# Altium project Tracking Radar PCB.PrjPcb (part 2 of 2)

## Sheet Debugger.SchDoc
size A4; Author: İlker KESER; Revision: V1.0; SheetNumber: 6; SheetTotal: 9; Page: 6; Page Total: 9; Project Code: 02050838; Template: A3
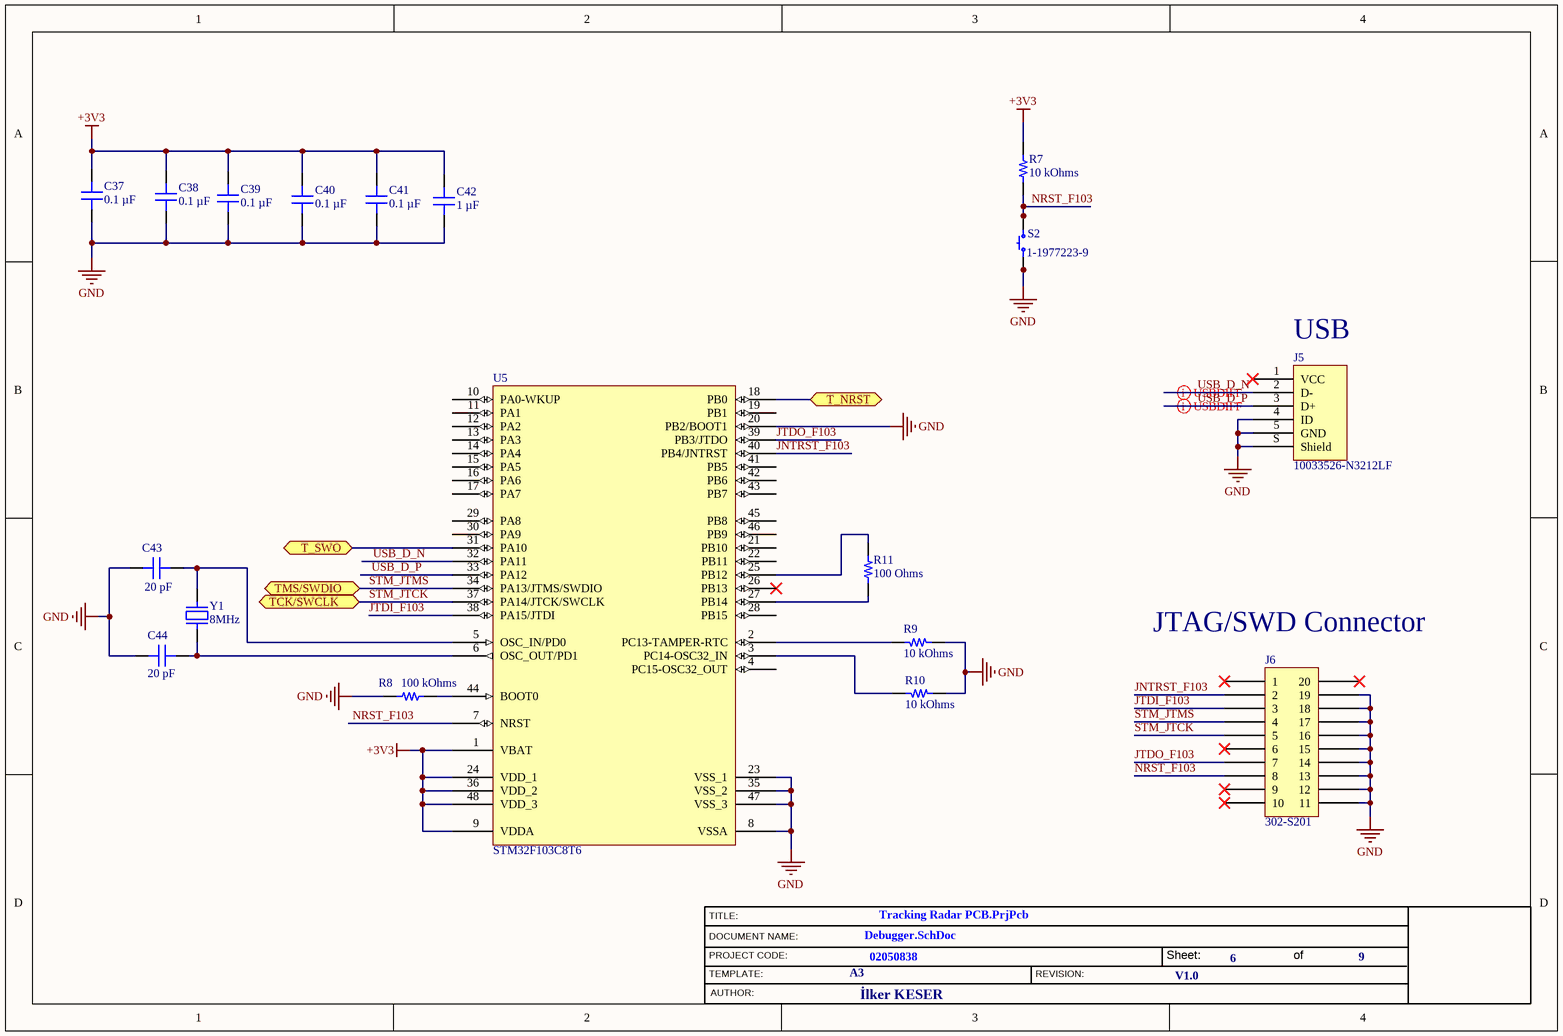
[diagram p5: Debugger.SchDoc]

### Parts
C37  0.1 µF  [CAP 0402_1005]
C38  0.1 µF  [CAP 0402_1005]
C39  0.1 µF  [CAP 0402_1005]
C40  0.1 µF  [CAP 0402_1005]
C41  0.1 µF  [CAP 0402_1005]
C42  1 µF  [CAP 0402_1005]
C43  20 pF  [CAP 0402_1005]
C44  20 pF  [CAP 0402_1005]
J5  10033526-N3212LF  [FCI USB 10033526-N3212LF]
J6  302-S201  [OST 302-S201]
R7  10 kOhms  [KOA RES RK73 RN73 0402_1005]
R8  100 kOhms  [YAGEO RES 0402_1005]
R9  10 kOhms  [KOA RES RK73 RN73 0402_1005]
R10  10 kOhms  [KOA RES RK73 RN73 0402_1005]
R11  100 Ohms  [YAGEO RES 0402_1005]
S2  1-1977223-9  [TE FSM6JSMA]
U5  STM32F103C8T6  [LQFP48_L]
Y1  8MHz  [TXC 9C]

### Ports
T_NRST (bidir, see Microcontroller[2C]), T_SWO (bidir, see Microcontroller[2A]), TCK/SWCLK (bidir, see Microcontroller[1B]), TMS/SWDIO (bidir, see Microcontroller[1B])

### Nets
+3V3: C37.2 C38.2 C39.2 C40.2 C41.2 C42.2 R7.1 U5.1(VBAT) U5.9(VDDA) U5.24(VDD_1) U5.36(VDD_2) U5.48(VDD_3)
GND: C37.1 C38.1 C39.1 C40.1 C41.1 C42.1 C43.1 C44.1 J5.4(ID) J5.5(GND) J5.S(Shield) J6.11 J6.12 J6.13 J6.14 J6.15 J6.16 J6.17 J6.18 J6.19 R8.1 R9.2 R10.2 S2.1 S2.2 U5.8(VSSA) U5.20(PB2/BOOT1) U5.23(VSS_1) U5.35(VSS_2) U5.47(VSS_3)
JNTRST_F103: J6.2 U5.40(PB4/JNTRST)
JTDI_F103: J6.3 U5.38(PA15/JTDI)
JTDO_F103: J6.7 U5.39(PB3/JTDO)
NRST: U5.18(PB0) ; port T_NRST
NRST_F103: J6.8 R7.2 S2.3 S2.4 U5.7(NRST)
STM_JTCK: J6.5 U5.37(PA14/JTCK/SWCLK) ; port TCK/SWCLK
STM_JTMS: J6.4 U5.34(PA13/JTMS/SWDIO) ; port TMS/SWDIO
USB_D_N: J5.2(D-) U5.32(PA11)
USB_D_P: J5.3(D+) U5.33(PA12)
NetC43_2: C43.2 U5.5(OSC_IN/PD0) Y1.2
NetC44_2: C44.2 U5.6(OSC_OUT/PD1) Y1.1
NetR8_2: R8.2 U5.44(BOOT0)
NetR9_1: R9.1 U5.2(PC13-TAMPER-RTC)
NetR10_1: R10.1 U5.3(PC14-OSC32_IN)
NetR11_1: R11.1 U5.27(PB14)
NetR11_2: R11.2 U5.25(PB12)
NetU4_89: U5.31(PA10) ; port T_SWO

Not connected (* = marked no-connect by the designer): J5 1(VCC)*; J6 1* 6* 9* 10* 20*; U5 4(PC15-OSC32_OUT) 10(PA0-WKUP) 11(PA1) 12(PA2) 13(PA3) 14(PA4) 15(PA5) 16(PA6) 17(PA7) 19(PB1) 21(PB10) 22(PB11) 26(PB13)* 28(PB15) 29(PA8) 30(PA9) 41(PB5) 42(PB6) 43(PB7) 45(PB8) 46(PB9)

### Layout directives
differential pair; differential pair class USB_DIFF: USB_D_N, USB_D_P

### Notes on the sheet
- (near J5) USB
- (near J6) JTAG/SWD Connector
- TITLE:
- DOCUMENT NAME:
- PROJECT CODE:
- TEMPLATE:
- REVISION:
- Sheet:
- of
- AUTHOR:

### Library data of the parts
C37-C41 = C0402C104M9PAC7867: CAP CER 0.1UF 6.3V X5R 0402; manufacturer: KEMET; Tolerance: ±20%; Part Number: C0402C104M9PAC7867; Capacitance: 0.1 µF; Applications: Bypass, Decoupling; componentlink1description: Datasheet; componentlink1url: https://api.kemet.com/component-edge/download/datasheet/C0402C104M9PACTU.pdf; componentlink2description: DigiKey Link; componentlink2url: https://www.digikey.com/en/products/detail/kemet/C0402C104M9PAC7867/2196244; Device Package: 0402 (1005 Metric); lastupdated: 9.02.2024 20:04:15; Lifecycle Status: Active; Minimum Order: 1; Mounting Type: Surface Mount, MLCC; Operating Temperature: -55°C ~ 85°C; Package / Case: 0402 (1005 Metric); packaging: CutTape; partid: 33676; Part Status: Active; price: 0.01; series: SMD Comm X5R; Size / Dimension: 0.039" L x 0.020" W (1.00mm x 0.50mm); Supplier 1: DigiKey; Supplier Part Number 1: 399-C0402C104M9PAC7867CT-ND; Temperature Coefficient: X5R; Thickness (Max): 0.022" (0.55mm); value: 0.1 µF; Voltage - Rated: 6.3V
C42 = GRM152R60J105ME15D: CAP CER 1UF 6.3V X5R 0402; manufacturer: Murata Electronics; Tolerance: ±20%; Part Number: GRM152R60J105ME15D; Capacitance: 1 µF; Applications: General Purpose; componentlink1description: Datasheet; componentlink1url: https://search.murata.co.jp/Ceramy/image/img/A01X/G101/ENG/GRM152R60J105ME15-01.pdf; componentlink2description: DigiKey Link; componentlink2url: https://www.digikey.com/en/products/detail/murata-electronics/GRM152R60J105ME15D/4904809; Device Package: 0402 (1005 Metric); lastupdated: 9.02.2024 20:04:33; Lifecycle Status: Active; Minimum Order: 1; Mounting Type: Surface Mount, MLCC; Operating Temperature: -55°C ~ 85°C; Package / Case: 0402 (1005 Metric); packaging: TapeAndReel; partid: 4147; Part Status: Active; price: 0.03; series: GRM; Size / Dimension: 0.039" L x 0.020" W (1.00mm x 0.50mm); Supplier 1: DigiKey; Supplier Part Number 1: 490-10006-1-ND; Temperature Coefficient: X5R; Thickness (Max): 0.009" (0.22mm); value: 1 µF; Voltage - Rated: 6.3V
C43 C44 = C0402C200K8GAC7867: CAP CER 20PF 10V NP0 0402; manufacturer: KEMET; Temperature Coefficient: C0G, NP0; Tolerance: ±10%; Part Number: C0402C200K8GAC7867; Capacitance: 20 pF; Applications: General Purpose; componentlink1description: Datasheet; componentlink1url: https://api.kemet.com/component-edge/download/datasheet/C0402C200K8GACTU.pdf; componentlink2description: DigiKey Link; componentlink2url: https://www.digikey.com/en/products/detail/kemet/C0402C200K8GAC7867/2196419; Device Package: 0402 (1005 Metric); Features: Low ESL; lastupdated: 9.02.2024 20:04:30; Lifecycle Status: Active; Minimum Order: 1; Mounting Type: Surface Mount, MLCC; Operating Temperature: -55°C ~ 125°C; Package / Case: 0402 (1005 Metric); packaging: TapeAndReel; partid: 6572; Part Status: Active; price: 0.06; series: SMD Comm C0G; Size / Dimension: 0.039" L x 0.020" W (1.00mm x 0.50mm); Supplier 1: DigiKey; Supplier Part Number 1: 399-14429-1-ND; Thickness (Max): 0.022" (0.55mm); value: 20 pF; Voltage - Rated: 10V
J5 = 10033526-N3212LF: CONN RCPT MINI USB B 5POS SMD RA; Manufacturer: Amphenol ICC (FCI); Connector Type: USB - mini B; Current Rating (Amps): 1A per Contact; Gender: Receptacle; Mating Cycles: 5000; Number of Contacts: 5; Number of Ports: 1; Shielding: Shielded; Voltage - Rated: 30V; Part Number: 10033526-N3212LF; ComponentLink1Description: Datasheet; ComponentLink1URL: http://www.amphenol-icc.com/media/wysiwyg/files/drawing/10033526.pdf; ComponentLink2Description: DigiKey Link; ComponentLink2URL: //digikey.com/product-detail/en/amphenol-icc-fci/10033526-N3212LF/609-4700-2-ND/4292074; Features: Board Guide, Solder Retention; LastUpdated: 9.12.2019 20:52:14; Lifecycle Status: 0; Minimum Order: 1; Mounting Feature: Horizontal; Mounting Type: Surface Mount, Right Angle; Operating Temperature: -25°C ~ 85°C; Packaging: TapeAndReel; Part Status: Active; Price: 0.39; Series: -; Supplier 1: DigiKey; Supplier Part Number 1: 609-4700-2-ND; Termination: Solder
J6 = 302-S201: CONN HEADER VERT 20POS 2.54MM; Manufacturer: On Shore Technology Inc.; Contact Length - Post: 0.122" (3.10mm); Current Rating (Amps): 3A; Material Flammability Rating: UL94 V-0; Number of Positions: 20; Number of Positions Loaded: All; Pitch - Mating: 0.100" (2.54mm); Shrouding: Shrouded - 4 Wall; Style: Board to Cable/Wire; Part Number: 302-S201; ComponentLink1Description: Datasheet; ComponentLink1URL: http://www.on-shore.com/wp-content/uploads/2018/04/302-SXX1.pdf; ComponentLink2Description: DigiKey Link; ComponentLink2URL: https://www.digikey.com/en/products/detail/on-shore-technology-inc/302-S201/2794235; Connector Type: Header; Contact Finish - Mating: Gold; Contact Finish - Post: Gold; Contact Finish Thickness - Mating: Flash; Contact Material: Brass; Contact Shape: Square; Contact Type: Male Pin; Fastening Type: Push-Pull; Features: Keying Slot; Insulation Color: Black; Insulation Height: 0.358" (9.10mm); Insulation Material: Polyester, Glass Filled; LastUpdated: 14.08.2022 17:03:46; Lifecycle Status: Active; Minimum Order: 1; Mounting Type: Through Hole; Number of Rows: 2; Operating Temperature: -40°C ~ 105°C; Packaging: Tray; PartId: 155; Part Status: Active; Price: 0.19; Row Spacing - Mating: 0.100" (2.54mm); Series: 302; Supplier 1: DigiKey; Supplier Part Number 1: ED10524-ND; Termination: Solder
R7 R9 R10 = RK73H1ETTP1002D: RES 10K OHM 0.5% 1/10W 0402; Manufacturer: KOA Speer Electronics, Inc.; Power (Watts): 0.1W, 1/10W; Temperature Coefficient: ±100ppm/°C; Part Number: RK73H1ETTP1002D; Value: 10 kOhms; ComponentLink1Description: Datasheet; ComponentLink1URL: http://www.koaspeer.com/catimages/Products/RK73H/RK73H.pdf; ComponentLink2Description: DigiKey Link; ComponentLink2URL: https://www.digikey.com/en/products/detail/koa-speer-electronics-inc/RK73H1ETTP1002D/9844692; Composition: Thick Film; Device Package: 0402 (1005 Metric); Features: Automotive AEC-Q200; Height - Seated (Max): 0.016" (0.40mm); LastUpdated: 25.07.2024 09:41:31; Lifecycle Status: Active; Minimum Order: 1; Number of Terminations: 2; Operating Temperature: -55°C ~ 155°C; Package / Case: 0402 (1005 Metric); Packaging: TapeAndReel; PartId: 14647; Part Status: Active; Price: 0.03; Ratings: AEC-Q200; Resistance: 10 kOhms; Series: RK73H; Size / Dimension: 0.039" L x 0.020" W (1.00mm x 0.50mm); Supplier 1: DigiKey; Supplier Part Number 1: 2019-RK73H1ETTP1002DCT-ND; Supplier Device Package: 0402; Tolerance: ±0.5%
R8 = RP0402BRD07100KL: RES 100K OHM 0.1% 1/16W 0402; Manufacturer: Yageo; Power (Watts): 0.063W, 1/16W; Temperature Coefficient: ±25ppm/°C; Part Number: RP0402BRD07100KL; Value: 100 kOhms; ComponentLink1Description: Datasheet; ComponentLink1URL: https://www.yageo.com/upload/media/product/products/datasheet/rchip/PYu-RP_51_RoHS_L_0.pdf; ComponentLink2Description: DigiKey Link; ComponentLink2URL: https://www.digikey.com/en/products/detail/yageo/RP0402BRD07100KL/16916706; Composition: Thin Film; Device Package: 0402 (1005 Metric); Features: Anti-Sulfur, Automotive AEC-Q200, Moisture Resistant; Height - Seated (Max): 0.014" (0.35mm); LastUpdated: 25.07.2024 09:18:00; Lifecycle Status: Active; Minimum Order: 1; Number of Terminations: 2; Operating Temperature: -55°C ~ 155°C; Package / Case: 0402 (1005 Metric); Packaging: TapeAndReel; PartId: 70016; Part Status: Active; Price: 0.06; Resistance: 100 kOhms; Series: RP; Size / Dimension: 0.039" L x 0.020" W (1.00mm x 0.50mm); Supplier 1: DigiKey; Supplier Part Number 1: 13-RP0402BRD07100KLCT-ND; Supplier Device Package: 0402; Tolerance: ±0.1%
R11 = RP0402BRD07100RL: RES 100 OHM 0.1% 1/16W 0402; Manufacturer: Yageo; Power (Watts): 0.063W, 1/16W; Temperature Coefficient: ±25ppm/°C; Part Number: RP0402BRD07100RL; Value: 100 Ohms; ComponentLink1Description: Datasheet; ComponentLink1URL: https://www.yageo.com/upload/media/product/products/datasheet/rchip/PYu-RP_51_RoHS_L_0.pdf; ComponentLink2Description: DigiKey Link; ComponentLink2URL: https://www.digikey.com/en/products/detail/yageo/RP0402BRD07100RL/16916732; Composition: Thin Film; Device Package: 0402 (1005 Metric); Features: Anti-Sulfur, Automotive AEC-Q200, Moisture Resistant; Height - Seated (Max): 0.014" (0.35mm); LastUpdated: 25.07.2024 09:18:00; Lifecycle Status: Active; Minimum Order: 1; Number of Terminations: 2; Operating Temperature: -55°C ~ 155°C; Package / Case: 0402 (1005 Metric); Packaging: TapeAndReel; PartId: 69963; Part Status: Active; Price: 0.06; Resistance: 100 Ohms; Series: RP; Size / Dimension: 0.039" L x 0.020" W (1.00mm x 0.50mm); Supplier 1: DigiKey; Supplier Part Number 1: 13-RP0402BRD07100RLCT-ND; Supplier Device Package: 0402; Tolerance: ±0.1%
S2 = 1-1977223-9: SWITCH TACTILE SPST-NO 0.05A 24V; Manufacturer: TE Connectivity ALCOSWITCH Switches; Actuator Height off PCB, Vertical: 7.00mm; Actuator Orientation: Top Actuated; Actuator Type: Standard; Contact Rating @ Voltage: 0.05A @ 24VDC; Illumination: Non-Illuminated; Operating Force: 260gf; Outline: 6.00mm x 6.00mm; Switch Function: Off-Mom; Part Number: 1-1977223-9; Circuit: SPST-NO; ComponentLink1Description: Datasheet; ComponentLink1URL: https://www.te.com/commerce/DocumentDelivery/DDEController?Action=srchrtrv&DocNm=1308111-1_SWITCHES_CORE_PROGRAM_CATALOG&DocType=CS&DocLang=English; ComponentLink2Description: DigiKey Link; ComponentLink2URL: http://digikey.com/product-detail/en/te-connectivity-alcoswitch-switches/1-1977223-9/1-1977223-9-ND/5401299; LastUpdated: 3.06.2024 20:19:31; Lifecycle Status: Active; Minimum Order: 1500; Mounting Type: Surface Mount; Packaging: Bulk; Price: 0.36; Series: FSMJSMA; Supplier 1: DigiKey; Supplier Part Number 1: 1-1977223-9-ND; Termination Style: Gull Wing
U5 = STM32F103C8T6: STM32 ARM-based 32-bit MCU with 64 Kbytes Flash, 48-pin LQFP, Industrial Temperature; Published: 30-May-2008; DatasheetVersion: rev6, Mar-2008; PackageVersion: Mar-2008; PackageReference: LQFP48; Publisher: Altium Limited; PackageDescription: 48-Pin Low-Profile Quad Flat Pack, 7 x 7 mm Body, 0.5 mm Pitch (LQFP48); ComponentLink1Description: Manufacturer Link; ComponentLink1URL: www.st.com/stm32; ComponentLink2Description: Datasheet; ComponentLink2URL: http://www.st.com/stonline/products/literature/ds/13587.pdf
Y1 = 9C-8.000MBBK-T: CRYSTAL 8.0000MHZ 20PF SMD; Manufacturer: TXC CORPORATION; ESR (Equivalent Series Resistance): 80 Ohms; Frequency Stability: ±50ppm; Operating Mode: Fundamental; Part Number: 9C-8.000MBBK-T; ComponentLink1Description: Datasheet; ComponentLink1URL: http://www.txccorp.com/download/products/quartz_crystals/2015TXC_9C_32.pdf; ComponentLink2Description: DigiKey Link; ComponentLink2URL: http://digikey.com/product-detail/en/txc-corporation/9C-8.000MBBK-T/887-2475-1-ND/4475454; Frequency: 8MHz; Frequency Tolerance: ±50ppm; Height - Seated (Max): 0.161" (4.10mm); LastUpdated: 3.06.2024 20:02:24; Lifecycle Status: Active; Load Capacitance: 20pF; Minimum Order: 1; Mounting Type: Surface Mount; Operating Temperature: -20°C ~ 70°C; Package / Case: HC-49S; Packaging: TapeAndReel; PartId: 697; Part Status: Active; Price: 0.18; Series: 9C; Size / Dimension: 0.449" L x 0.189" W (11.40mm x 4.80mm); Supplier 1: DigiKey; Supplier Part Number 1: 887-2475-1-ND; Type: MHz Crystal; Value: 8MHz

## Sheet LoRa_Com.SchDoc
size A4; Author: İlker KESER; Revision: V1.0; SheetNumber: 7; SheetTotal: 9; Page: 7; Project Code: 02050838; Template: A4; Page Total: 9
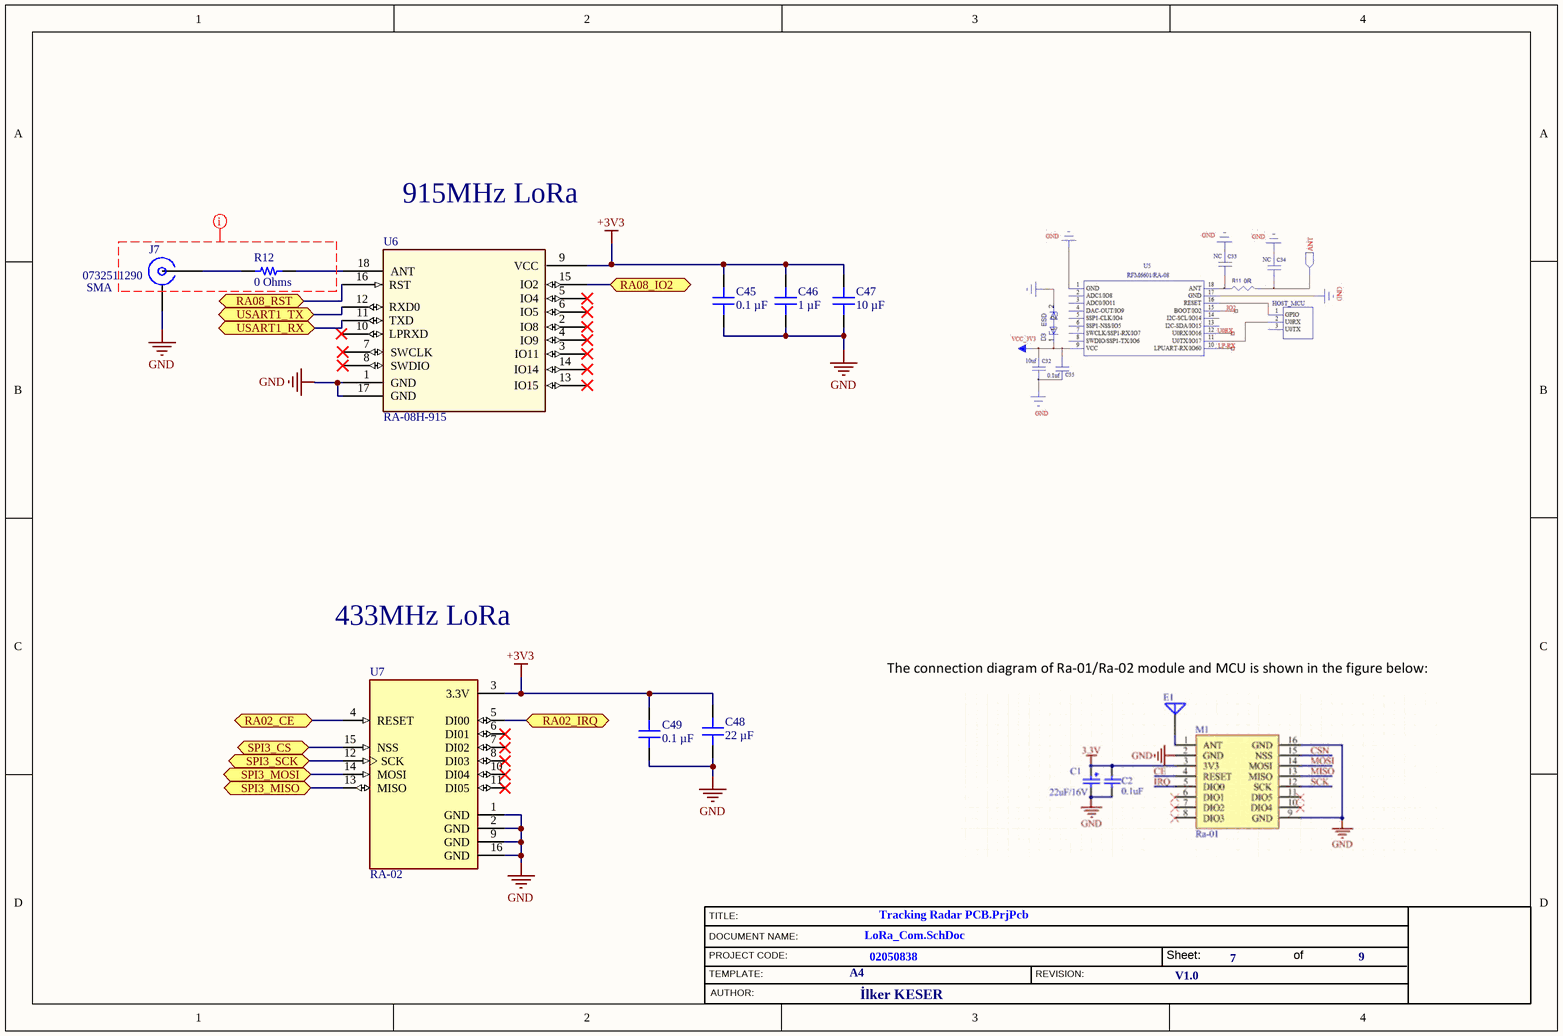
[diagram p6: LoRa_Com.SchDoc]

### Parts
C45  0.1 µF  [CAP 0402_1005]
C46  1 µF  [CAP 0402_1005]
C47  10 µF  [MURATA GRM188 0603_1608]
C48  22 µF  [MURATA GRM188 0603_1608]
C49  0.1 µF  [CAP 0603_1608]
J7  0732511290  Connector Style: SMA  [MOLEX SD-73251-129]
R12  0 Ohms  [RES 1206_3216]
U6  RA-08H-915  [RA-08H-915]
U7  RA-02  [RA-02]

### Ports
RA02_CE (bidir, see Microcontroller[2B]), RA02_IRQ (bidir, see Microcontroller[2B]), RA08_IO2 (bidir, see Microcontroller[1B]), RA08_RST (bidir, see Microcontroller[1A]), SPI3_CS (bidir, see Microcontroller[2B]), SPI3_MISO (bidir, see Microcontroller[1C]), SPI3_MOSI (bidir, see Microcontroller[1C]), SPI3_SCK (bidir, see Microcontroller[1C]), USART1_RX (bidir, see Microcontroller[1B]), USART1_TX (bidir, see Microcontroller[1B])

### Nets
+3V3: C45.2 C46.2 C47.2 C48.2 C49.2 U6.9(VCC) U7.3(3.3V)
GND: C45.1 C46.1 C47.1 C48.1 C49.1 J7.G(GND) U6.1(GND) U6.17(GND) U7.1(GND) U7.2(GND) U7.9(GND) U7.16(GND)
NetJ7_S: J7.S(SIGNAL) R12.1
NetR12_2: R12.2 U6.18(ANT)
NetU4_66: U6.15(IO2) ; port RA08_IO2
NetU4_67: U6.16(RST) ; port RA08_RST
NetU4_68: U6.12(RXD0) ; port USART1_TX
NetU4_69: U6.11(TXD) ; port USART1_RX
NetU4_78: U7.12(SCK) ; port SPI3_SCK
NetU4_79: U7.13(MISO) ; port SPI3_MISO
NetU4_80: U7.14(MOSI) ; port SPI3_MOSI
NetU4_81: U7.15(NSS) ; port SPI3_CS
NetU4_82: U7.5(DI00) ; port RA02_IRQ
NetU4_83: U7.4(RESET) ; port RA02_CE

Not connected (* = marked no-connect by the designer): U6 2(IO8)* 3(IO11)* 4(IO9)* 5(IO4)* 6(IO5)* 7(SWCLK)* 8(SWDIO)* 10(LPRXD)* 13(IO15)* 14(IO14)*; U7 6(DI01)* 7(DI02)* 8(DI03)* 10(DI04)* 11(DI05)*

### Layout directives
net class 50OHM: (no net found under the mark)

### Notes on the sheet
- 915MHz LoRa
- 433MHz LoRa
- TITLE:
- DOCUMENT NAME:
- PROJECT CODE:
- TEMPLATE:
- REVISION:
- Sheet:
- of
- AUTHOR:

### Library data of the parts
C45 = C0402C104M9PAC7867: as C37 on sheet Debugger; Part Number: C0402C104M9PAC7867; Capacitance: 0.1 µF; Applications: Bypass, Decoupling; componentlink1description: Datasheet; componentlink1url: https://api.kemet.com/component-edge/download/datasheet/C0402C104M9PACTU.pdf; componentlink2description: DigiKey Link; componentlink2url: https://www.digikey.com/en/products/detail/kemet/C0402C104M9PAC7867/2196244; Device Package: 0402 (1005 Metric); lastupdated: 9.02.2024 20:04:15; Lifecycle Status: Active; Minimum Order: 1; Mounting Type: Surface Mount, MLCC; Operating Temperature: -55°C ~ 85°C; Package / Case: 0402 (1005 Metric); packaging: CutTape; partid: 33676; Part Status: Active; price: 0.01; series: SMD Comm X5R; Size / Dimension: 0.039" L x 0.020" W (1.00mm x 0.50mm); Supplier 1: DigiKey; Supplier Part Number 1: 399-C0402C104M9PAC7867CT-ND; Temperature Coefficient: X5R; Thickness (Max): 0.022" (0.55mm); value: 0.1 µF; Voltage - Rated: 6.3V
C46 = GRM152R60J105ME15D: as C42 on sheet Debugger; Part Number: GRM152R60J105ME15D; Capacitance: 1 µF; Applications: General Purpose; componentlink1description: Datasheet; componentlink1url: https://search.murata.co.jp/Ceramy/image/img/A01X/G101/ENG/GRM152R60J105ME15-01.pdf; componentlink2description: DigiKey Link; componentlink2url: https://www.digikey.com/en/products/detail/murata-electronics/GRM152R60J105ME15D/4904809; Device Package: 0402 (1005 Metric); lastupdated: 9.02.2024 20:04:33; Lifecycle Status: Active; Minimum Order: 1; Mounting Type: Surface Mount, MLCC; Operating Temperature: -55°C ~ 85°C; Package / Case: 0402 (1005 Metric); packaging: TapeAndReel; partid: 4147; Part Status: Active; price: 0.03; series: GRM; Size / Dimension: 0.039" L x 0.020" W (1.00mm x 0.50mm); Supplier 1: DigiKey; Supplier Part Number 1: 490-10006-1-ND; Temperature Coefficient: X5R; Thickness (Max): 0.009" (0.22mm); value: 1 µF; Voltage - Rated: 6.3V
C47 = GRM188R61A106MAALD: CAP CER 10UF 10V X5R 0603; manufacturer: Murata Electronics; Tolerance: ±20%; Part Number: GRM188R61A106MAALD; Capacitance: 10 µF; Applications: General Purpose; componentlink1description: Datasheet; componentlink1url: https://search.murata.co.jp/Ceramy/image/img/A01X/G101/ENG/GRM188R61A106MAAL-01.pdf; componentlink2description: DigiKey Link; componentlink2url: https://www.digikey.com/en/products/detail/murata-electronics/GRM188R61A106MAALD/4905335; Device Package: 0603 (1608 Metric); lastupdated: 20.07.2024 00:23:22; Lifecycle Status: Active; Minimum Order: 1; Mounting Type: Surface Mount, MLCC; Operating Temperature: -55°C ~ 85°C; Package / Case: 0603 (1608 Metric); packaging: TapeAndReel; partid: 40505; Part Status: Active; price: 0.03; series: GRM; Size / Dimension: 0.063" L x 0.031" W (1.60mm x 0.80mm); Supplier 1: DigiKey; Supplier Part Number 1: 490-12734-1-ND; Temperature Coefficient: X5R; Thickness (Max): 0.037" (0.95mm); value: 10 µF; Voltage - Rated: 10V
C48 = GRM188C61C226ME01W: CAP CER 22UF 16V X5S 0603; manufacturer: Murata Electronics; Tolerance: ±20%; Part Number: GRM188C61C226ME01W; Capacitance: 22 µF; Applications: General Purpose; componentlink1description: Datasheet; componentlink1url: https://search.murata.co.jp/Ceramy/image/img/A01X/G101/ENG/GRM188C61C226ME01-01A.pdf; componentlink2description: DigiKey Link; componentlink2url: https://www.digikey.com/en/products/detail/murata-electronics/GRM188C61C226ME01W/22528390; Device Package: 0603 (1608 Metric); lastupdated: 20.07.2024 00:23:18; Lifecycle Status: Active; Minimum Order: 1; Mounting Type: Surface Mount, MLCC; Operating Temperature: -55°C ~ 85°C; Package / Case: 0603 (1608 Metric); packaging: TapeAndReel; partid: 60288; price: 0.09; series: GRM; Size / Dimension: 0.063" L x 0.031" W (1.60mm x 0.80mm); Supplier 1: DigiKey; Supplier Part Number 1: 490-GRM188C61C226ME01WCT-ND; Temperature Coefficient: X5S; Thickness (Max): 0.039" (1.00mm); value: 22 µF; Voltage - Rated: 16V
C49 = 885012206046: CAP CER 0.1UF 16V X7R 0603; manufacturer: Würth Elektronik; Tolerance: ±10%; Part Number: 885012206046; Capacitance: 0.1 µF; Applications: General Purpose; componentlink1description: Datasheet; componentlink1url: https://katalog.we-online.de/pbs/datasheet/885012206046.pdf; componentlink2description: DigiKey Link; componentlink2url: https://www.digikey.com/en/products/detail/würth-elektronik/885012206046/5453820; Device Package: 0603 (1608 Metric); lastupdated: 9.02.2024 20:10:12; Lifecycle Status: Active; Minimum Order: 1; Mounting Type: Surface Mount, MLCC; Operating Temperature: -55°C ~ 125°C; Package / Case: 0603 (1608 Metric); packaging: TapeAndReel; partid: 15291; Part Status: Active; price: 0.03; series: WCAP-CSGP; Size / Dimension: 0.063" L x 0.031" W (1.60mm x 0.80mm); Supplier 1: DigiKey; Supplier Part Number 1: 732-7965-1-ND; Temperature Coefficient: X7R; Thickness (Max): 0.034" (0.87mm); value: 0.1 µF; Voltage - Rated: 16V
J7 = 0732511290: CONN SMA JACK STR 50OHM EDGE MNT; Manufacturer: Molex; Connector Type: Jack, Female Socket; Contact Termination: Solder; Frequency - Max: 18 GHz; Number of Ports: 1; Part Number: 0732511290; ComponentLink1Description: Datasheet; ComponentLink1URL: https://www.molex.com/pdm_docs/ps/PS-89675-346.pdf; ComponentLink2Description: DigiKey Link; ComponentLink2URL: https://www.digikey.com/en/products/detail/molex/0732511290/3878247; Fastening Type: Threaded; Housing Color: Gold; Impedance: 50Ohm; LastUpdated: 29.06.2022 18:07:55; Lifecycle Status: Active; Minimum Order: 1; Mounting Feature: Bulkhead - Front Side Nut; Mounting Type: Board Edge, End Launch; Panel Mount; Packaging: Tray; Part Status: Active; Price: 4.46; Series: 73251; Shield Termination: Solder; Supplier 1: DigiKey; Supplier Part Number 1: WM9461-ND
R12 = CRCW12060000Z0EB: RES SMD 0 OHM JUMPER 1/4W 1206; Manufacturer: Vishay Dale; Power (Watts): 0.25W, 1/4W; Part Number: CRCW12060000Z0EB; ComponentLink1Description: Datasheet; ComponentLink1URL: http://www.vishay.com/docs/20035/dcrcwe3.pdf; ComponentLink2Description: DigiKey Link; ComponentLink2URL: https://www.digikey.com/en/products/detail/vishay-dale/CRCW12060000Z0EB/5076259; Composition: Thick Film; Device Package: 1206 (3216 Metric); Features: Automotive AEC-Q200; Height - Seated (Max): 0.024" (0.60mm); LastUpdated: 9.02.2024 20:54:45; Lifecycle Status: Active; Minimum Order: 1; Number of Terminations: 2; Operating Temperature: -55°C ~ 155°C; Package / Case: 1206 (3216 Metric); Packaging: TapeAndReel; PartId: 26977; Part Status: Active; Price: 0.01; Ratings: AEC-Q200; Resistance: 0 Ohms; Series: CRCW; Size / Dimension: 0.126" L x 0.063" W (3.20mm x 1.60mm); Supplier 1: DigiKey; Supplier Part Number 1: 541-3032-1-ND; Supplier Device Package: 1206; Tolerance: Jumper; Value: 0 Ohms
U6 = RA-08H-915: RF TXRX MODULE 915MHZ LORAWAN; Manufacturer: Ai-Thinker; ComponentLink1Description: Datasheet; ComponentLink1URL: https://docs.ai-thinker.com/_media/lora/docs/ra-08h_v1.1.0_specification.pdf; ComponentLink2Description: Digikey Link; ComponentLink2URL: https://www.digikey.com/en/products/detail/ai-thinker/RA-08H-915/16707689
U7 = RA-02: General ISM < 1GHz LoRa™ Transceiver Module 410MHz ~ 525MHz Antenna Not Included, I-PEX Surface Mount; Manufacturer: Ai-Thinker; Current - Transmitting: 93mA ~ 97mA; Current - Receiving: 12.15mA; Voltage - Supply: 2.5V ~ 3.7V; Serial Interfaces: SPI; Protocol: LoRa; Modulation: FSK, GFSK, GMSK, MSK, OOK; Data Rate: 300kbps; Power - Output: 18dBm; Sensitivity: -141dBm; ComponentLink1Description: Product Specification; ComponentLink1URL: https://docs.ai-thinker.com/_media/lora/docs/c048ps01a1_ra-02_product_specification_v1.1.pdf; ComponentLink2Description: Digikey Link; ComponentLink2URL: https://www.digikey.com/en/products/detail/ai-thinker/RA-02/16688840; Package / Case: 16-SMD Module; Operating Temperature: -30°C ~ 85°C; Mounting Type: Surface Mount; Antenna Type: Antenna Not Included, I-PEX; RF Family/Standard: General ISM < 1GHz; Frequency: 410MHz ~ 525MHz

## Sheet GPS_GNSS.SchDoc
size A3; Author: İlker KESER; Revision: V1.0; SheetNumber: 8; SheetTotal: 9; Page: 8; Page Total: 9; Template: A3; Project Code: 02050838
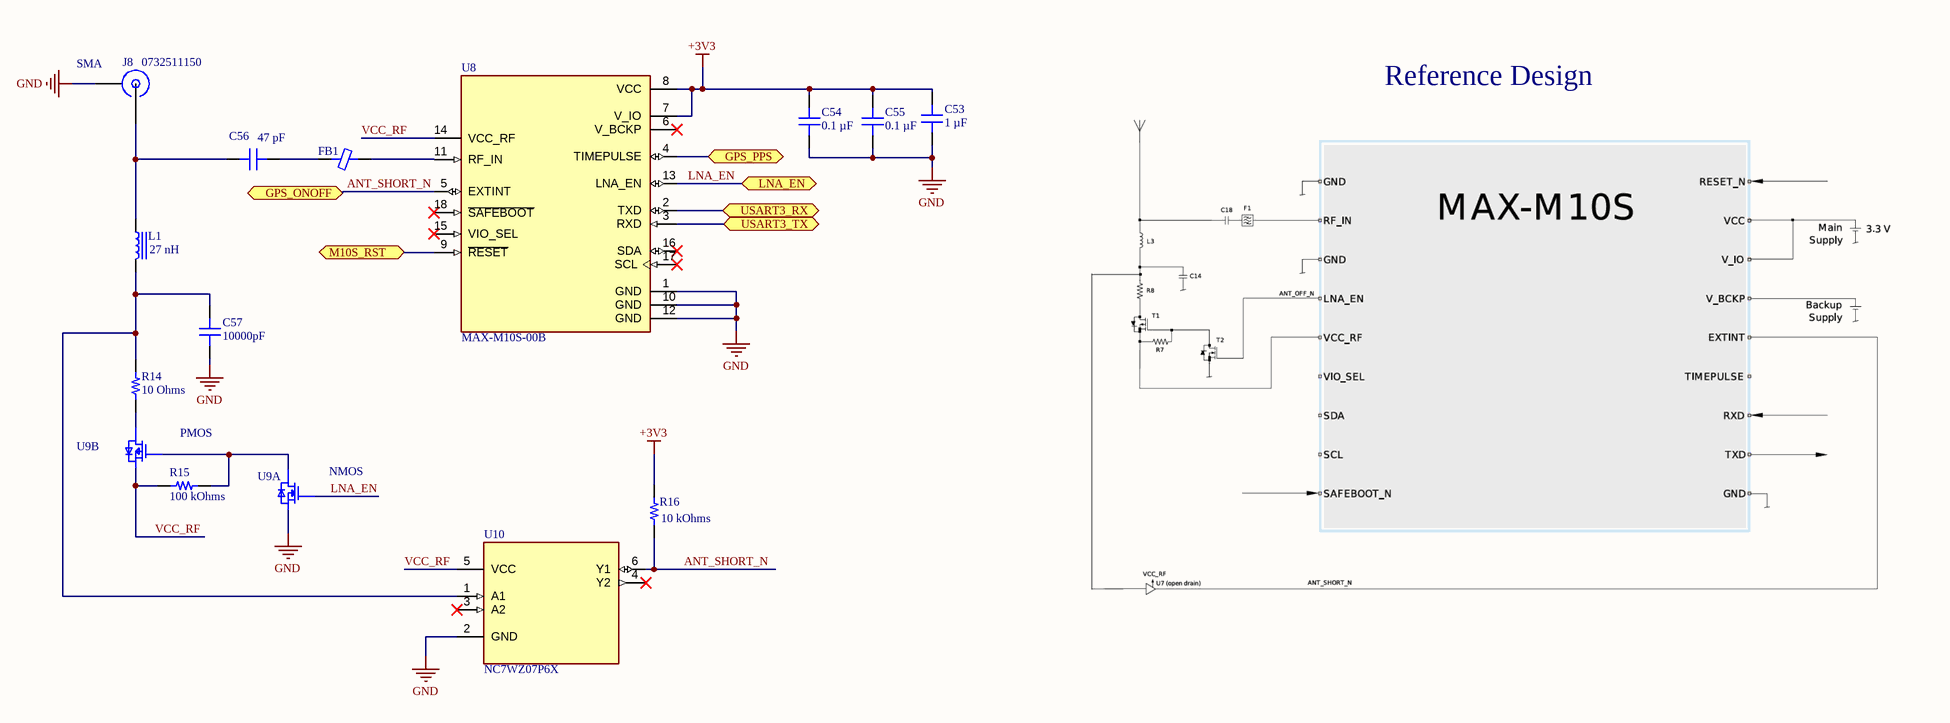
[diagram p7: GPS_GNSS.SchDoc]

### Parts
C53  1 µF  [MURATA GRM155 0402_1005]
C54  0.1 µF  [CAP 0402_1005]
C55  0.1 µF  [CAP 0402_1005]
C56  47 pF  [CAP 0402_1005]
C57  10000pF  [CAP 0603_1608 RF]
FB1  1 kOhms @ 100 MHz  [FER 0402_1005]  (value not drawn)
J8  0732511150  Connector Style: SMA  [MOLEX SD-73251-115]
L1  27 nH  [Murata LQG15 0402]
R14  10 Ohms  [YAGEO RES 0402_1005]
R15  100 kOhms  [YAGEO RES 0603_1608]
R16  10 kOhms  [KOA RES RK73 RN73 0402_1005]
U8  MAX-M10S-00B  [MAX-M10S-00B]
U9  DMC2700UDM-7  [SOT-23-6]  (value not drawn)  (parts A,B of 2)
U10  NC7WZ07P6X  [NC7WZ07P6X]

### Ports
GPS_ONOFF (bidir, see Microcontroller[2C]), GPS_PPS (bidir, see Microcontroller[2C]), LNA_EN (bidir, see Microcontroller[2C]), M10S_RST (bidir, see Microcontroller[2C]), USART3_RX (bidir, see Microcontroller[2B]), USART3_TX (bidir, see Microcontroller[2B])

### Nets
+3V3: C53.2 C54.2 C55.2 R16.1 U8.7(V_IO) U8.8(VCC)
GND: C53.1 C54.1 C55.1 C57.2 J8.G(GND) U8.1(GND) U8.10(GND) U8.12(GND) U9.5(S1) U10.2(GND)
ANT_SHORT_N: R16.2 U8.5(EXTINT) U10.6(Y1) ; port GPS_ONOFF
LNA_EN: U8.13(LNA_EN) U9.1(G1) ; port LNA_EN
VCC_RF: R15.1 U8.14(VCC_RF) U9.2(S2) U10.5(VCC)
NetC56_1: C56.1 J8.S(SIGNAL) L1.1
NetC56_2: C56.2 FB1.1
NetC57_1: C57.1 L1.2 R14.2 U10.1(A1)
NetFB1_2: FB1.2 U8.11(RF_IN)
NetR14_1: R14.1 U9.4(D2)
NetR15_2: R15.2 U9.3(G2) U9.6(D1)
NetU4_55: U8.3(RXD) ; port USART3_TX
NetU4_56: U8.2(TXD) ; port USART3_RX
NetU4_57: U8.9(~{RESET}) ; port M10S_RST
NetU4_60: U8.4(TIMEPULSE) ; port GPS_PPS

Not connected (* = marked no-connect by the designer): U8 6(V_BCKP)* 15(VIO_SEL)* 16(SDA)* 17(SCL)* 18(~{SAFEBOOT})*; U10 3(A2)* 4(Y2)*

### Notes on the sheet
- Reference Design
- TITLE:
- DOCUMENT NAME:
- PROJECT CODE:
- TEMPLATE:
- REVISION:
- Sheet:
- of
- AUTHOR:
- (in symbol DMC2700UDM-7, part A) NMOS
- (in symbol DMC2700UDM-7, part B) PMOS

### Library data of the parts
C53 = GRM155Z71A105KE01J: CAP CER 1UF 10V X7R 0402; manufacturer: Murata Electronics; Tolerance: ±10%; Part Number: GRM155Z71A105KE01J; Capacitance: 1 µF; Applications: General Purpose; componentlink1description: Datasheet; componentlink1url: https://search.murata.co.jp/Ceramy/image/img/A01X/G101/ENG/GRM155Z71A105KE01-01A.pdf; componentlink2description: DigiKey Link; componentlink2url: https://www.digikey.com/en/products/detail/murata-electronics/GRM155Z71A105KE01J/16033607; Device Package: 0402 (1005 Metric); lastupdated: 27.08.2024 12:42:50; Lifecycle Status: Active; Minimum Order: 1; Mounting Type: Surface Mount, MLCC; Operating Temperature: -55°C ~ 125°C; Package / Case: 0402 (1005 Metric); packaging: TapeAndReel; partid: 41629; Part Status: Active; price: 0.01; series: GRM; Size / Dimension: 0.039" L x 0.020" W (1.00mm x 0.50mm); Supplier 1: DigiKey; Supplier Part Number 1: 490-GRM155Z71A105KE01JCT-ND; Temperature Coefficient: X7R; Thickness (Max): 0.024" (0.60mm); value: 1 µF; Voltage - Rated: 10V
C54 C55 = 885012205018: CAP CER 0.1UF 10V X7R 0402; manufacturer: Würth Elektronik; Tolerance: ±10%; Part Number: 885012205018; Capacitance: 0.1 µF; Applications: General Purpose; componentlink1description: Datasheet; componentlink1url: https://katalog.we-online.de/pbs/datasheet/885012205018.pdf; componentlink2description: DigiKey Link; componentlink2url: https://www.digikey.com/en/products/detail/würth-elektronik/885012205018/5453368; Device Package: 0402 (1005 Metric); lastupdated: 9.02.2024 20:04:24; Lifecycle Status: Active; Minimum Order: 1; Mounting Type: Surface Mount, MLCC; Operating Temperature: -55°C ~ 125°C; Package / Case: 0402 (1005 Metric); packaging: TapeAndReel; partid: 10108; Part Status: Active; price: 0.01; series: WCAP-CSGP; Size / Dimension: 0.039" L x 0.020" W (1.00mm x 0.50mm); Supplier 1: DigiKey; Supplier Part Number 1: 732-7513-1-ND; Temperature Coefficient: X7R; Thickness (Max): 0.022" (0.55mm); value: 0.1 µF; Voltage - Rated: 10V
C56 = C0402C470J3GACAUTO: CAP CER 47PF 25V C0G/NP0 0402; manufacturer: KEMET; Temperature Coefficient: C0G, NP0; Tolerance: ±5%; Part Number: C0402C470J3GACAUTO; Capacitance: 47 pF; Applications: Automotive; componentlink1description: Datasheet; componentlink1url: https://connect.kemet.com:7667/gateway/IntelliData-ComponentDocumentation/1.0/download/datasheet/C0402C470J3GACAUTO; componentlink2description: DigiKey Link; componentlink2url: https://www.digikey.com/en/products/detail/kemet/C0402C470J3GACAUTO/10642318; Device Package: 0402 (1005 Metric); Features: Low ESL; lastupdated: 9.02.2024 20:04:06; Lifecycle Status: Active; Minimum Order: 1; Mounting Type: Surface Mount, MLCC; Operating Temperature: -55°C ~ 125°C; Package / Case: 0402 (1005 Metric); packaging: TapeAndReel; partid: 47193; Part Status: Active; price: 0.01; Ratings: AEC-Q200; series: SMD Auto C0G; Size / Dimension: 0.039" L x 0.020" W (1.00mm x 0.50mm); Supplier 1: DigiKey; Supplier Part Number 1: 399-C0402C470J3GACAUTOCT-ND; Thickness (Max): 0.022" (0.55mm); value: 47 pF; Voltage - Rated: 25V
C57 = EMK107SD103KA-T: CAP CER 10000PF 16V 0603; manufacturer: Taiyo Yuden; Tolerance: ±10%; Part Number: EMK107SD103KA-T; Applications: RF, Microwave, High Frequency; Capacitance: 10000pF; componentlink1description: Datasheet; componentlink1url: http://www.yuden.co.jp/productdata/catalog/mlcc07_e.pdf; componentlink2description: DigiKey Link; componentlink2url: http://digikey.com/product-detail/en/taiyo-yuden/EMK107SD103KA-T/587-1094-1-ND/930871; Device Package: 0603 (1608 Metric); Features: Low Distortion; lastupdated: 2.09.2020 01:17:15; Lifecycle Status: Active; Minimum Order: 1; Mounting Type: Surface Mount, MLCC; Operating Temperature: -55°C ~ 125°C; Package / Case: 0603 (1608 Metric); packaging: TapeAndReel; partid: 1412; Part Status: Active; price: 0.07; series: CFCAP™; Size / Dimension: 0.063" L x 0.031" W (1.60mm x 0.80mm); Supplier 1: DigiKey; Supplier Part Number 1: 587-1094-1-ND; Thickness (Max): 0.035" (0.90mm); value: 10000pF; Voltage - Rated: 16V
FB1 = BLM15AG102SN1D: FERRITE BEAD 1K OHM 0402 1LN; Manufacturer: Murata Electronics; Current Rating (Max): 300mA; DC Resistance (DCR) (Max): 650mOhm; Number of Lines: 1; Part Number: BLM15AG102SN1D; ComponentLink1Description: Datasheet; ComponentLink1URL: https://www.murata.com/en-us/products/productdata/8796740059166/ENFA0018.pdf; ComponentLink2Description: DigiKey Link; ComponentLink2URL: https://www.digikey.com/en/products/detail/murata-electronics/BLM15AG102SN1D/584218; Device Package: 0402 (1005 Metric); Height (Max): 0.022" (0.55mm); Impedance @ Frequency: 1 kOhms @ 100 MHz; LastUpdated: 3.06.2024 19:51:04; Lifecycle Status: Active; Minimum Order: 1; Mounting Type: Surface Mount; Operating Temperature: -55°C ~ 125°C; Package / Case: 0402 (1005 Metric); Packaging: TapeAndReel; PartId: 387; Part Status: Active; Price: 0.01; Series: EMIFIL®, BLM15; Size / Dimension: 0.039" L x 0.022" W (1.00mm x 0.55mm); Supplier 1: DigiKey; Supplier Part Number 1: 490-1007-1-ND; Value: 1 kOhms @ 100 MHz
J8 = 0732511150: CONN SMA RCPT STR 50OHM EDGE MNT; Manufacturer: Molex; Connector Type: Receptacle, Female Socket; Contact Termination: Solder; Frequency - Max: 18 GHz; Number of Ports: 1; Part Number: 0732511150; ComponentLink1Description: Datasheet; ComponentLink1URL: https://www.molex.com/pdm_docs/ps/PS-89675-346.pdf; ComponentLink2Description: DigiKey Link; ComponentLink2URL: https://www.digikey.com/en/products/detail/molex/0732511150/1465156; Fastening Type: Threaded; Housing Color: Gold; Impedance: 50Ohm; LastUpdated: 29.06.2022 18:06:18; Lifecycle Status: Active; Minimum Order: 1; Mounting Type: Board Edge, End Launch; Packaging: Tray; Part Status: Active; Price: 2.16; Series: 73251; Shield Termination: Solder; Supplier 1: DigiKey; Supplier Part Number 1: WM5534-ND
L1 = LQG15HZ27NJ02D: FIXED IND 27NH 350MA 0.46OHM SMD; Manufacturer: Murata Electronics; DC Resistance (DCR): 460mOhm Max; Frequency - Self Resonant: 1.7GHz; Inductance Frequency - Test: 100 MHz; Material - Core: Air; Q @ Freq: 8 @ 100MHz; Shielding: Unshielded; Tolerance: ±5%; Type: Multilayer; Part Number: LQG15HZ27NJ02D; ComponentLink1Description: Datasheet; ComponentLink1URL: https://search.murata.co.jp/Ceramy/image/img/P02/JELF243B-9110.pdf; ComponentLink2Description: DigiKey Link; ComponentLink2URL: https://www.digikey.com/en/products/detail/murata-electronics/LQG15HZ27NJ02D/8323902; Current Rating (Amps): 350 mA; Device Package: 0402 (1005 Metric); Height - Seated (Max): 0.022" (0.55mm); Inductance: 27 nH; LastUpdated: 19.07.2024 23:59:46; Lifecycle Status: Active; Minimum Order: 1; Mounting Type: Surface Mount; Operating Temperature: -55°C ~ 125°C; Package / Case: 0402 (1005 Metric); Packaging: TapeAndReel; PartId: 2424; Part Status: Active; Price: 0.02; Ratings: AEC-Q200; Series: LQG15; Size / Dimension: 0.039" L x 0.020" W (1.00mm x 0.50mm); Supplier 1: DigiKey; Supplier Part Number 1: 490-LQG15HZ27NJ02DCT-ND; Supplier Device Package: 0402 (1005 Metric); Value: 27 nH
R14 = RC0402JR-0710RL: RES 10 OHM 5% 1/16W 0402; Manufacturer: Yageo; Power (Watts): 0.063W, 1/16W; Temperature Coefficient: ±200ppm/°C; Part Number: RC0402JR-0710RL; Value: 10 Ohms; ComponentLink1Description: Datasheet; ComponentLink1URL: https://www.yageo.com/upload/media/product/productsearch/datasheet/rchip/PYu-RC_Group_51_RoHS_L_10.pdf; ComponentLink2Description: DigiKey Link; ComponentLink2URL: https://www.digikey.com/en/products/detail/yageo/RC0402JR-0710RL/726417; Composition: Thick Film; Device Package: 0402 (1005 Metric); Features: Moisture Resistant; Height - Seated (Max): 0.016" (0.40mm); LastUpdated: 25.07.2024 09:18:18; Lifecycle Status: Active; Minimum Order: 1; Number of Terminations: 2; Operating Temperature: -55°C ~ 155°C; Package / Case: 0402 (1005 Metric); Packaging: CutTape; PartId: 3405; Part Status: Active; Price: 0.01; Resistance: 10 Ohms; Series: RC_L; Size / Dimension: 0.039" L x 0.020" W (1.00mm x 0.50mm); Supplier 1: DigiKey; Supplier Part Number 1: 311-10JRCT-ND; Supplier Device Package: 0402; Tolerance: ±5%
R15 = AA0603FR-07100KL: RES SMD 100K OHM 1% 1/10W 0603; Manufacturer: Yageo; Power (Watts): 0.1W, 1/10W; Temperature Coefficient: ±150ppm/°C; Part Number: AA0603FR-07100KL; Value: 100 kOhms; ComponentLink1Description: Datasheet; ComponentLink1URL: https://www.yageo.com/upload/media/product/productsearch/datasheet/rchip/PYu-AA_51_RoHS_L_3.pdf; ComponentLink2Description: DigiKey Link; ComponentLink2URL: https://www.digikey.com/en/products/detail/yageo/AA0603FR-07100KL/5888687; Composition: Thick Film; Device Package: 0603 (1608 Metric); Features: Anti-Sulfur, Automotive AEC-Q200, Moisture Resistant; Height - Seated (Max): 0.022" (0.55mm); LastUpdated: 25.07.2024 09:19:03; Lifecycle Status: Active; Minimum Order: 1; Number of Terminations: 2; Operating Temperature: -55°C ~ 155°C; Package / Case: 0603 (1608 Metric); Packaging: TapeAndReel; PartId: 78895; Price: 0.01; Ratings: AEC-Q200; Resistance: 100 kOhms; Series: AA; Size / Dimension: 0.063" L x 0.031" W (1.60mm x 0.80mm); Supplier 1: DigiKey; Supplier Part Number 1: 13-AA0603FR-07100KLCT-ND; Supplier Device Package: 0603; Tolerance: ±1%
R16 = RK73H1ETTP1002D: as R7 on sheet Debugger; Part Number: RK73H1ETTP1002D; Value: 10 kOhms; ComponentLink1Description: Datasheet; ComponentLink1URL: http://www.koaspeer.com/catimages/Products/RK73H/RK73H.pdf; ComponentLink2Description: DigiKey Link; ComponentLink2URL: https://www.digikey.com/en/products/detail/koa-speer-electronics-inc/RK73H1ETTP1002D/9844692; Composition: Thick Film; Device Package: 0402 (1005 Metric); Features: Automotive AEC-Q200; Height - Seated (Max): 0.016" (0.40mm); LastUpdated: 25.07.2024 09:41:31; Lifecycle Status: Active; Minimum Order: 1; Number of Terminations: 2; Operating Temperature: -55°C ~ 155°C; Package / Case: 0402 (1005 Metric); Packaging: TapeAndReel; PartId: 14647; Part Status: Active; Price: 0.03; Ratings: AEC-Q200; Resistance: 10 kOhms; Series: RK73H; Size / Dimension: 0.039" L x 0.020" W (1.00mm x 0.50mm); Supplier 1: DigiKey; Supplier Part Number 1: 2019-RK73H1ETTP1002DCT-ND; Supplier Device Package: 0402; Tolerance: ±0.5%
U8 = MAX-M10S-00B: MAX-M10 RF Receiver BeiDou, Galileo, GLONASS, GPS, GNSS 1.561GHz, 1.575GHz, 1.602GHz -167dBm 921.6kbps Not Included Module; Manufacturer: ublox; Data Interface: I2C,UART; Voltage - Supply: 1.76V ~ 3.6V; Sensitivity: -167dBm; Frequency: 1.561GHz, 1.575GHz, 1.602GHz; Modulation or Protocol: BeiDou, Galileo, GLONASS, GPS, GNSS; Data Rate (Max): 921.6kbps; Applications: GPS/GNSS Receiver; Antenna Connector: Not Included; Operating Temperature: -40°C ~ 85°C; Mounting Type: Surface Mount; ComponentLink1Description: Datasheet; ComponentLink1URL: https://content.u-blox.com/sites/default/files/MAX-M10S_DataSheet_UBX-20035208.pdf; ComponentLink2Description: Digikey Link; ComponentLink2URL: https://www.digikey.com/en/products/detail/u-blox/max-m10s-00b/15712906
U9 = DMC2700UDM-7: Mosfet Array 20V 1.34A, 1.14A 1.12W Surface Mount SOT-26; Manufacturer: Diodes Incorporated; Configuration: N and P-Channel; FET Feature: Logic Level Gate; Rds On (Max) @ Id, Vgs: 400mOhm @ 600mA, 4.5V; Vgs(th) (Max) @ Id: 1V @ 250µA; Gate Charge (Qg) (Max) @ Vgs: 0.74nC @ 4.5V; Input Capacitance (Ciss) (Max) @ Vds: 60.67pF @ 16V; ComponentLink1Description: Datasheet; ComponentLink1URL: https://www.diodes.com/assets/Datasheets/DMC2700UDM.pdf; ComponentLink2Description: Digikey Link; ComponentLink2URL: https://www.digikey.com/en/products/detail/diodes-incorporated/DMC2700UDM-7/2765657; Technology: MOSFET (Metal Oxide); Drain to Source Voltage (Vdss): 20V; Current - Continuous Drain (Id) @ 25°C: 1.34A, 1.14A; Power - Max: 1.12W; Operating Temperature: -55°C ~ 150°C (TJ); Package / Case: SOT-23-6
U10 = NC7WZ07P6X: Buffer, Non-Inverting 2 Element 1 Bit per Element Open Drain Output SC-88 (SC-70-6); Manufacturer: onsemi; Number of Elements: 2; Number of Bits per Element: 1; Current - Output High, Low: -, 32mA; Voltage - Supply: 1.65V ~ 5.5V; Logic Type: Buffer, Non-Inverting; Output Type: Open Drain; Operating Temperature: -40°C ~ 85°C (TA); Mounting Type: Surface Mount; Package / Case: 6-TSSOP, SC-88, SOT-363; Supplier Device Package: SC-88 (SC-70-6); ComponentLink1Description: Datasheet; ComponentLink1URL: https://www.onsemi.com/pdf/datasheet/nc7wz07-d.pdf; ComponentLink2Description: Digikey link; ComponentLink2URL: https://www.digikey.com/en/products/detail/onsemi/nc7wz07p6x/965440

## Sheet Angular_Encoder.SchDoc
size A4; Author: İlker KESER; Revision: V1.0; SheetNumber: 9; SheetTotal: 9; Page: 9; Page Total: 9; Template: A4; Project Code: 02050838
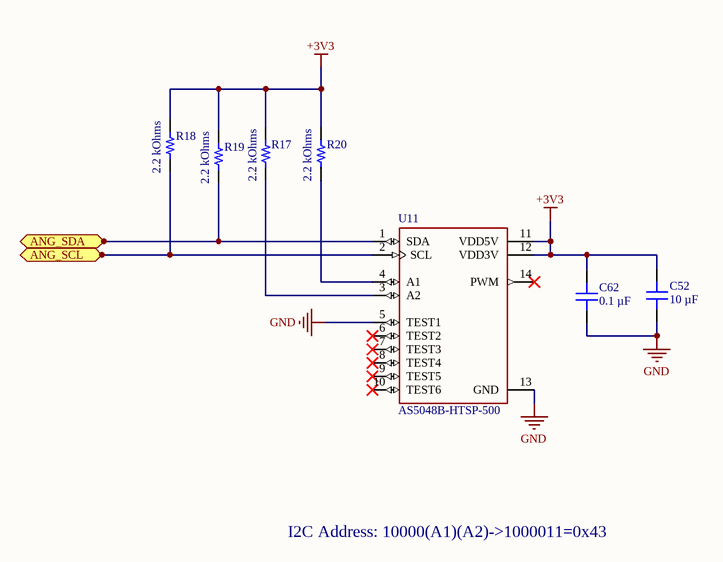
[diagram p8: Angular_Encoder.SchDoc]

### Parts
C52  10 µF  [CAP 0603_1608]
C62  0.1 µF  [CAP 0402_1005]
R17  2.2 kOhms  [YAGEO RES 0402_1005]
R18  2.2 kOhms  [YAGEO RES 0402_1005]
R19  2.2 kOhms  [YAGEO RES 0402_1005]
R20  2.2 kOhms  [YAGEO RES 0402_1005]
U11  AS5048B-HTSP-500  [AS5048B-HTSP-500]

### Ports
ANG_SCL (bidir, see Microcontroller[2A]), ANG_SDA (bidir, see Microcontroller[2B])

### Nets
+3V3: C52.2 C62.2 R17.2 R18.2 R19.2 R20.2 U11.11(VDD5V) U11.12(VDD3V)
GND: C52.1 C62.1 U11.5(TEST1) U11.13(GND)
NetR17_1: R17.1 U11.3(A2)
NetR18_1: R18.1 U11.2(SCL) ; port ANG_SCL
NetR19_1: R19.1 U11.1(SDA) ; port ANG_SDA
NetR20_1: R20.1 U11.4(A1)

Not connected (* = marked no-connect by the designer): U11 6(TEST2)* 7(TEST3)* 8(TEST4)* 9(TEST5)* 10(TEST6)* 14(PWM)*

### Notes on the sheet
- I2C Address: 10000(A1)(A2)->1000011=0x43
- TITLE:
- DOCUMENT NAME:
- PROJECT CODE:
- TEMPLATE:
- REVISION:
- Sheet:
- of
- AUTHOR:

### Library data of the parts
C52 = CC0603MRX5R7BB106: CAP CER 10UF 16V X5R 0603; manufacturer: Yageo; Tolerance: ±20%; Part Number: CC0603MRX5R7BB106; Capacitance: 10 µF; Applications: General Purpose; componentlink1description: Datasheet; componentlink1url: https://www.yageo.com/upload/media/product/productsearch/datasheet/mlcc/UPY-GPHC_X5R_4V-to-50V_26.pdf; componentlink2description: DigiKey Link; componentlink2url: https://www.digikey.com/en/products/detail/yageo/CC0603MRX5R7BB106/5195229; Device Package: 0603 (1608 Metric); lastupdated: 9.02.2024 20:09:51; Lifecycle Status: Active; Minimum Order: 1; Mounting Type: Surface Mount, MLCC; Operating Temperature: -55°C ~ 85°C; Package / Case: 0603 (1608 Metric); packaging: TapeAndReel; partid: 41163; Part Status: Active; price: 0.08; series: CC; Size / Dimension: 0.063" L x 0.031" W (1.60mm x 0.80mm); Supplier 1: DigiKey; Supplier Part Number 1: 311-1822-1-ND; Temperature Coefficient: X5R; Thickness (Max): 0.035" (0.90mm); value: 10 µF; Voltage - Rated: 16V
C62 = C0402C104M9PAC7867: as C37 on sheet Debugger; Part Number: C0402C104M9PAC7867; Capacitance: 0.1 µF; Applications: Bypass, Decoupling; componentlink1description: Datasheet; componentlink1url: https://api.kemet.com/component-edge/download/datasheet/C0402C104M9PACTU.pdf; componentlink2description: DigiKey Link; componentlink2url: https://www.digikey.com/en/products/detail/kemet/C0402C104M9PAC7867/2196244; Device Package: 0402 (1005 Metric); lastupdated: 9.02.2024 20:04:15; Lifecycle Status: Active; Minimum Order: 1; Mounting Type: Surface Mount, MLCC; Operating Temperature: -55°C ~ 85°C; Package / Case: 0402 (1005 Metric); packaging: CutTape; partid: 33676; Part Status: Active; price: 0.01; series: SMD Comm X5R; Size / Dimension: 0.039" L x 0.020" W (1.00mm x 0.50mm); Supplier 1: DigiKey; Supplier Part Number 1: 399-C0402C104M9PAC7867CT-ND; Temperature Coefficient: X5R; Thickness (Max): 0.022" (0.55mm); value: 0.1 µF; Voltage - Rated: 6.3V
R17-R20 = RC0402FR-072K2L: RES 2.2K OHM 1% 1/16W 0402; Manufacturer: Yageo; Power (Watts): 0.063W, 1/16W; Temperature Coefficient: ±100ppm/°C; Part Number: RC0402FR-072K2L; Value: 2.2 kOhms; ComponentLink1Description: Datasheet; ComponentLink1URL: https://www.yageo.com/upload/media/product/productsearch/datasheet/rchip/PYu-RC_Group_51_RoHS_L_10.pdf; ComponentLink2Description: DigiKey Link; ComponentLink2URL: https://www.digikey.com/en/products/detail/yageo/RC0402FR-072K2L/726553; Composition: Thick Film; Device Package: 0402 (1005 Metric); Features: Moisture Resistant; Height - Seated (Max): 0.016" (0.40mm); LastUpdated: 25.07.2024 09:18:11; Lifecycle Status: Active; Minimum Order: 1; Number of Terminations: 2; Operating Temperature: -55°C ~ 155°C; Package / Case: 0402 (1005 Metric); Packaging: CutTape; PartId: 17607; Part Status: Active; Price: 0.01; Resistance: 2.2 kOhms; Series: RC_L; Size / Dimension: 0.039" L x 0.020" W (1.00mm x 0.50mm); Supplier 1: DigiKey; Supplier Part Number 1: 311-2.20KLRCT-ND; Supplier Device Package: 0402; Tolerance: ±1%
U11 = AS5048B-HTSP-500: Hall Effect Sensor Angle External Magnet, Not Included Gull Wing; Manufacturer: ams-OSRAM USA INC.; Rotation Angle - Electrical, Mechanical: 0° ~ 360°, Continuous; Output: I2C, PWM; Voltage - Supply: 3V ~ 3.6V, 4.5V ~ 5.5V; ComponentLink1Description: Datasheet; ComponentLink1URL: https://s3.amazonaws.com/snapeda/datasheet/AS5048B-HTSP-500_ams.pdf; ComponentLink2Description: Digikey Link; ComponentLink2URL: https://www.digikey.com/en/products/detail/ams-osram-usa-inc/AS5048B-HTSP-500/3188616; For Measuring: Angle; Technology: Hall Effect; Actuator Type: External Magnet, Not Included; Mounting Type: Surface Mount; Termination Style: Gull Wing; Operating Temperature: -40°C ~ 150°C; Package / Case: 14-TSSOP (0.173", 4.40mm Width); Supplier Device Package: 14-TSSOP

## Nets that join several sheets
+3V3: Power Management (6 pins), Microcontroller (20 pins), Debugger (12 pins), LoRa_Com (7 pins), GPS_GNSS (6 pins), Angular_Encoder (8 pins)
+12V: Power Management (D2.2 D3.1 IC1.4 R1.1), Motor_Drivers (15 pins)
GND: Power Management (20 pins), Motor_Drivers (21 pins), Microcontroller (24 pins), Debugger (30 pins), LoRa_Com (12 pins), GPS_GNSS (10 pins), Angular_Encoder (C52.1 C62.1 U11.5 U11.13)
ANT_SHORT_N: Microcontroller (U4.59), GPS_GNSS (R16.2 U8.5 U10.6)
LNA_EN: Microcontroller (U4.58), GPS_GNSS (U8.13 U9.1)
NetR18_1: Microcontroller (U4.95), Angular_Encoder (R18.1 U11.2)
NetR19_1: Microcontroller (U4.96), Angular_Encoder (R19.1 U11.1)
NetU2_2: Motor_Drivers (U2.2), Microcontroller (U4.45)
NetU2_3: Motor_Drivers (U2.3), Microcontroller (U4.44)
NetU3_2: Motor_Drivers (U3.2), Microcontroller (U4.32)
NetU3_3: Motor_Drivers (U3.3), Microcontroller (U4.31)
NetU4_55: Microcontroller (U4.55), GPS_GNSS (U8.3)
NetU4_56: Microcontroller (U4.56), GPS_GNSS (U8.2)
NetU4_57: Microcontroller (U4.57), GPS_GNSS (U8.9)
NetU4_60: Microcontroller (U4.60), GPS_GNSS (U8.4)
NetU4_66: Microcontroller (U4.66), LoRa_Com (U6.15)
NetU4_67: Microcontroller (U4.67), LoRa_Com (U6.16)
NetU4_68: Microcontroller (U4.68), LoRa_Com (U6.12)
NetU4_69: Microcontroller (U4.69), LoRa_Com (U6.11)
NetU4_78: Microcontroller (U4.78), LoRa_Com (U7.12)
NetU4_79: Microcontroller (U4.79), LoRa_Com (U7.13)
NetU4_80: Microcontroller (U4.80), LoRa_Com (U7.14)
NetU4_81: Microcontroller (U4.81), LoRa_Com (U7.15)
NetU4_82: Microcontroller (U4.82), LoRa_Com (U7.5)
NetU4_83: Microcontroller (U4.83), LoRa_Com (U7.4)
NetU4_89: Microcontroller (U4.89), Debugger (U5.31)
NRST: Microcontroller (5 pins), Debugger (U5.18)
STM_JTCK: Microcontroller (U4.76), Debugger (J6.5 U5.37)
STM_JTMS: Microcontroller (U4.72), Debugger (J6.4 U5.34)
TIM2_IN1: Motor_Drivers (U1.3), Microcontroller (U4.47)
TIM2_IN2: Motor_Drivers (U1.2), Microcontroller (U4.48)